# Altium project EDR.PrjPcb
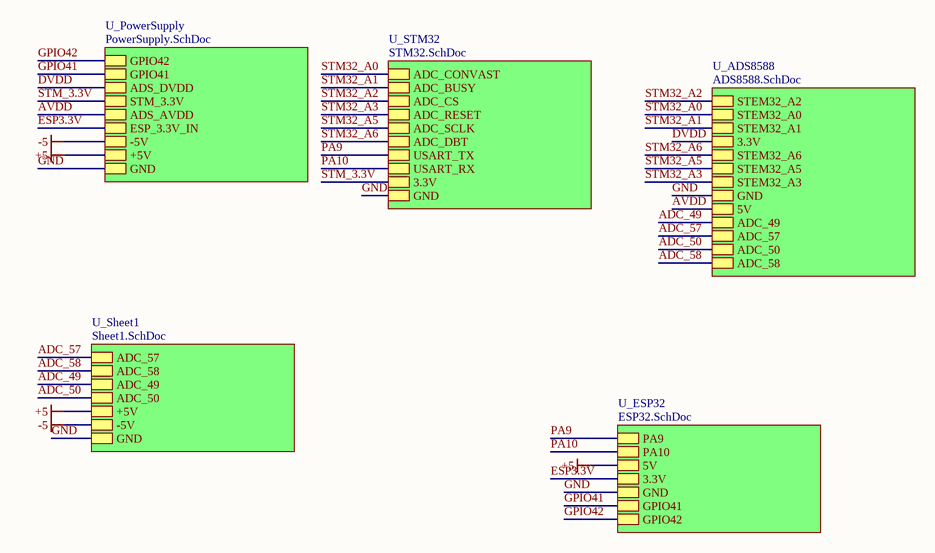
[diagram p0: Main.SchDoc]
6 sheets, 162 parts. Net scope: hierarchical (ports join the sheet entries above them; power ports are global).
Board file: EDR.PcbDoc
Sheets:
  Main.SchDoc
    U_PowerSupply = PowerSupply.SchDoc
    U_STM32 = STM32.SchDoc
    U_Sheet1 = Sheet1.SchDoc
    U_ADS8588 = ADS8588.SchDoc
    U_ESP32 = ESP32.SchDoc

## Sheet Main.SchDoc
size A; SheetNumber: 1; SheetTotal: 6

### Sub-sheets
U_ADS8588 = ADS8588.SchDoc: STEM32_A2, STEM32_A0, STEM32_A1, 3.3V, STEM32_A6, STEM32_A5, STEM32_A3, GND, 5V, ADC_49, ADC_57, ADC_50, ADC_58
U_ESP32 = ESP32.SchDoc: PA9, PA10, 5V, 3.3V, GND, GPIO41, GPIO42
U_PowerSupply = PowerSupply.SchDoc: GPIO42, GPIO41, ADS_DVDD, STM_3.3V, ADS_AVDD, ESP_3.3V_IN, -5V, +5V, GND
U_Sheet1 = Sheet1.SchDoc: ADC_57, ADC_58, ADC_49, ADC_50, +5V, -5V, GND
U_STM32 = STM32.SchDoc: ADC_CONVAST, ADC_BUSY, ADC_CS, ADC_RESET, ADC_SCLK, ADC_DBT, USART_TX, USART_RX, 3.3V, GND

### Nets
+5: sheet U_PowerSupply/+5V, sheet U_Sheet1/+5V, sheet U_ESP32/5V
-5: sheet U_PowerSupply/-5V, sheet U_Sheet1/-5V  [project net VOUT]
ESP3.3V: sheet U_PowerSupply/ESP_3.3V_IN, sheet U_ESP32/3.3V  [project net 3.3V]
GND: sheet U_PowerSupply/GND, sheet U_STM32/GND, sheet U_Sheet1/GND, sheet U_ADS8588/GND, sheet U_ESP32/GND
ADC_49: sheet U_Sheet1/ADC_49, sheet U_ADS8588/ADC_49
ADC_50: sheet U_Sheet1/ADC_50, sheet U_ADS8588/ADC_50
ADC_57: sheet U_Sheet1/ADC_57, sheet U_ADS8588/ADC_57
ADC_58: sheet U_Sheet1/ADC_58, sheet U_ADS8588/ADC_58
AVDD: sheet U_PowerSupply/ADS_AVDD, sheet U_ADS8588/5V  [project net 5V]
DVDD: sheet U_PowerSupply/ADS_DVDD, sheet U_ADS8588/3.3V  [project net 3.3V_ADC]
GPIO41: sheet U_PowerSupply/GPIO41, sheet U_ESP32/GPIO41
GPIO42: sheet U_PowerSupply/GPIO42, sheet U_ESP32/GPIO42
PA9: sheet U_STM32/USART_TX, sheet U_ESP32/PA9
PA10: sheet U_STM32/USART_RX, sheet U_ESP32/PA10
STM32_A0: sheet U_STM32/ADC_CONVAST, sheet U_ADS8588/STEM32_A0  [project net STEM32_A0]
STM32_A1: sheet U_STM32/ADC_BUSY, sheet U_ADS8588/STEM32_A1  [project net STEM32_A1]
STM32_A2: sheet U_STM32/ADC_CS, sheet U_ADS8588/STEM32_A2  [project net STEM32_A2]
STM32_A3: sheet U_STM32/ADC_RESET, sheet U_ADS8588/STEM32_A3  [project net STEM32_A3]
STM32_A5: sheet U_STM32/ADC_SCLK, sheet U_ADS8588/STEM32_A5  [project net STEM32_A5]
STM32_A6: sheet U_STM32/ADC_DBT, sheet U_ADS8588/STEM32_A6  [project net STEM32_A6]
STM_3.3V: sheet U_PowerSupply/STM_3.3V, sheet U_STM32/3.3V  [project net STEM32 3.3V]

## Sheet PowerSupply.SchDoc
size 420 x 297 mm; SheetNumber: 4; SheetTotal: 6
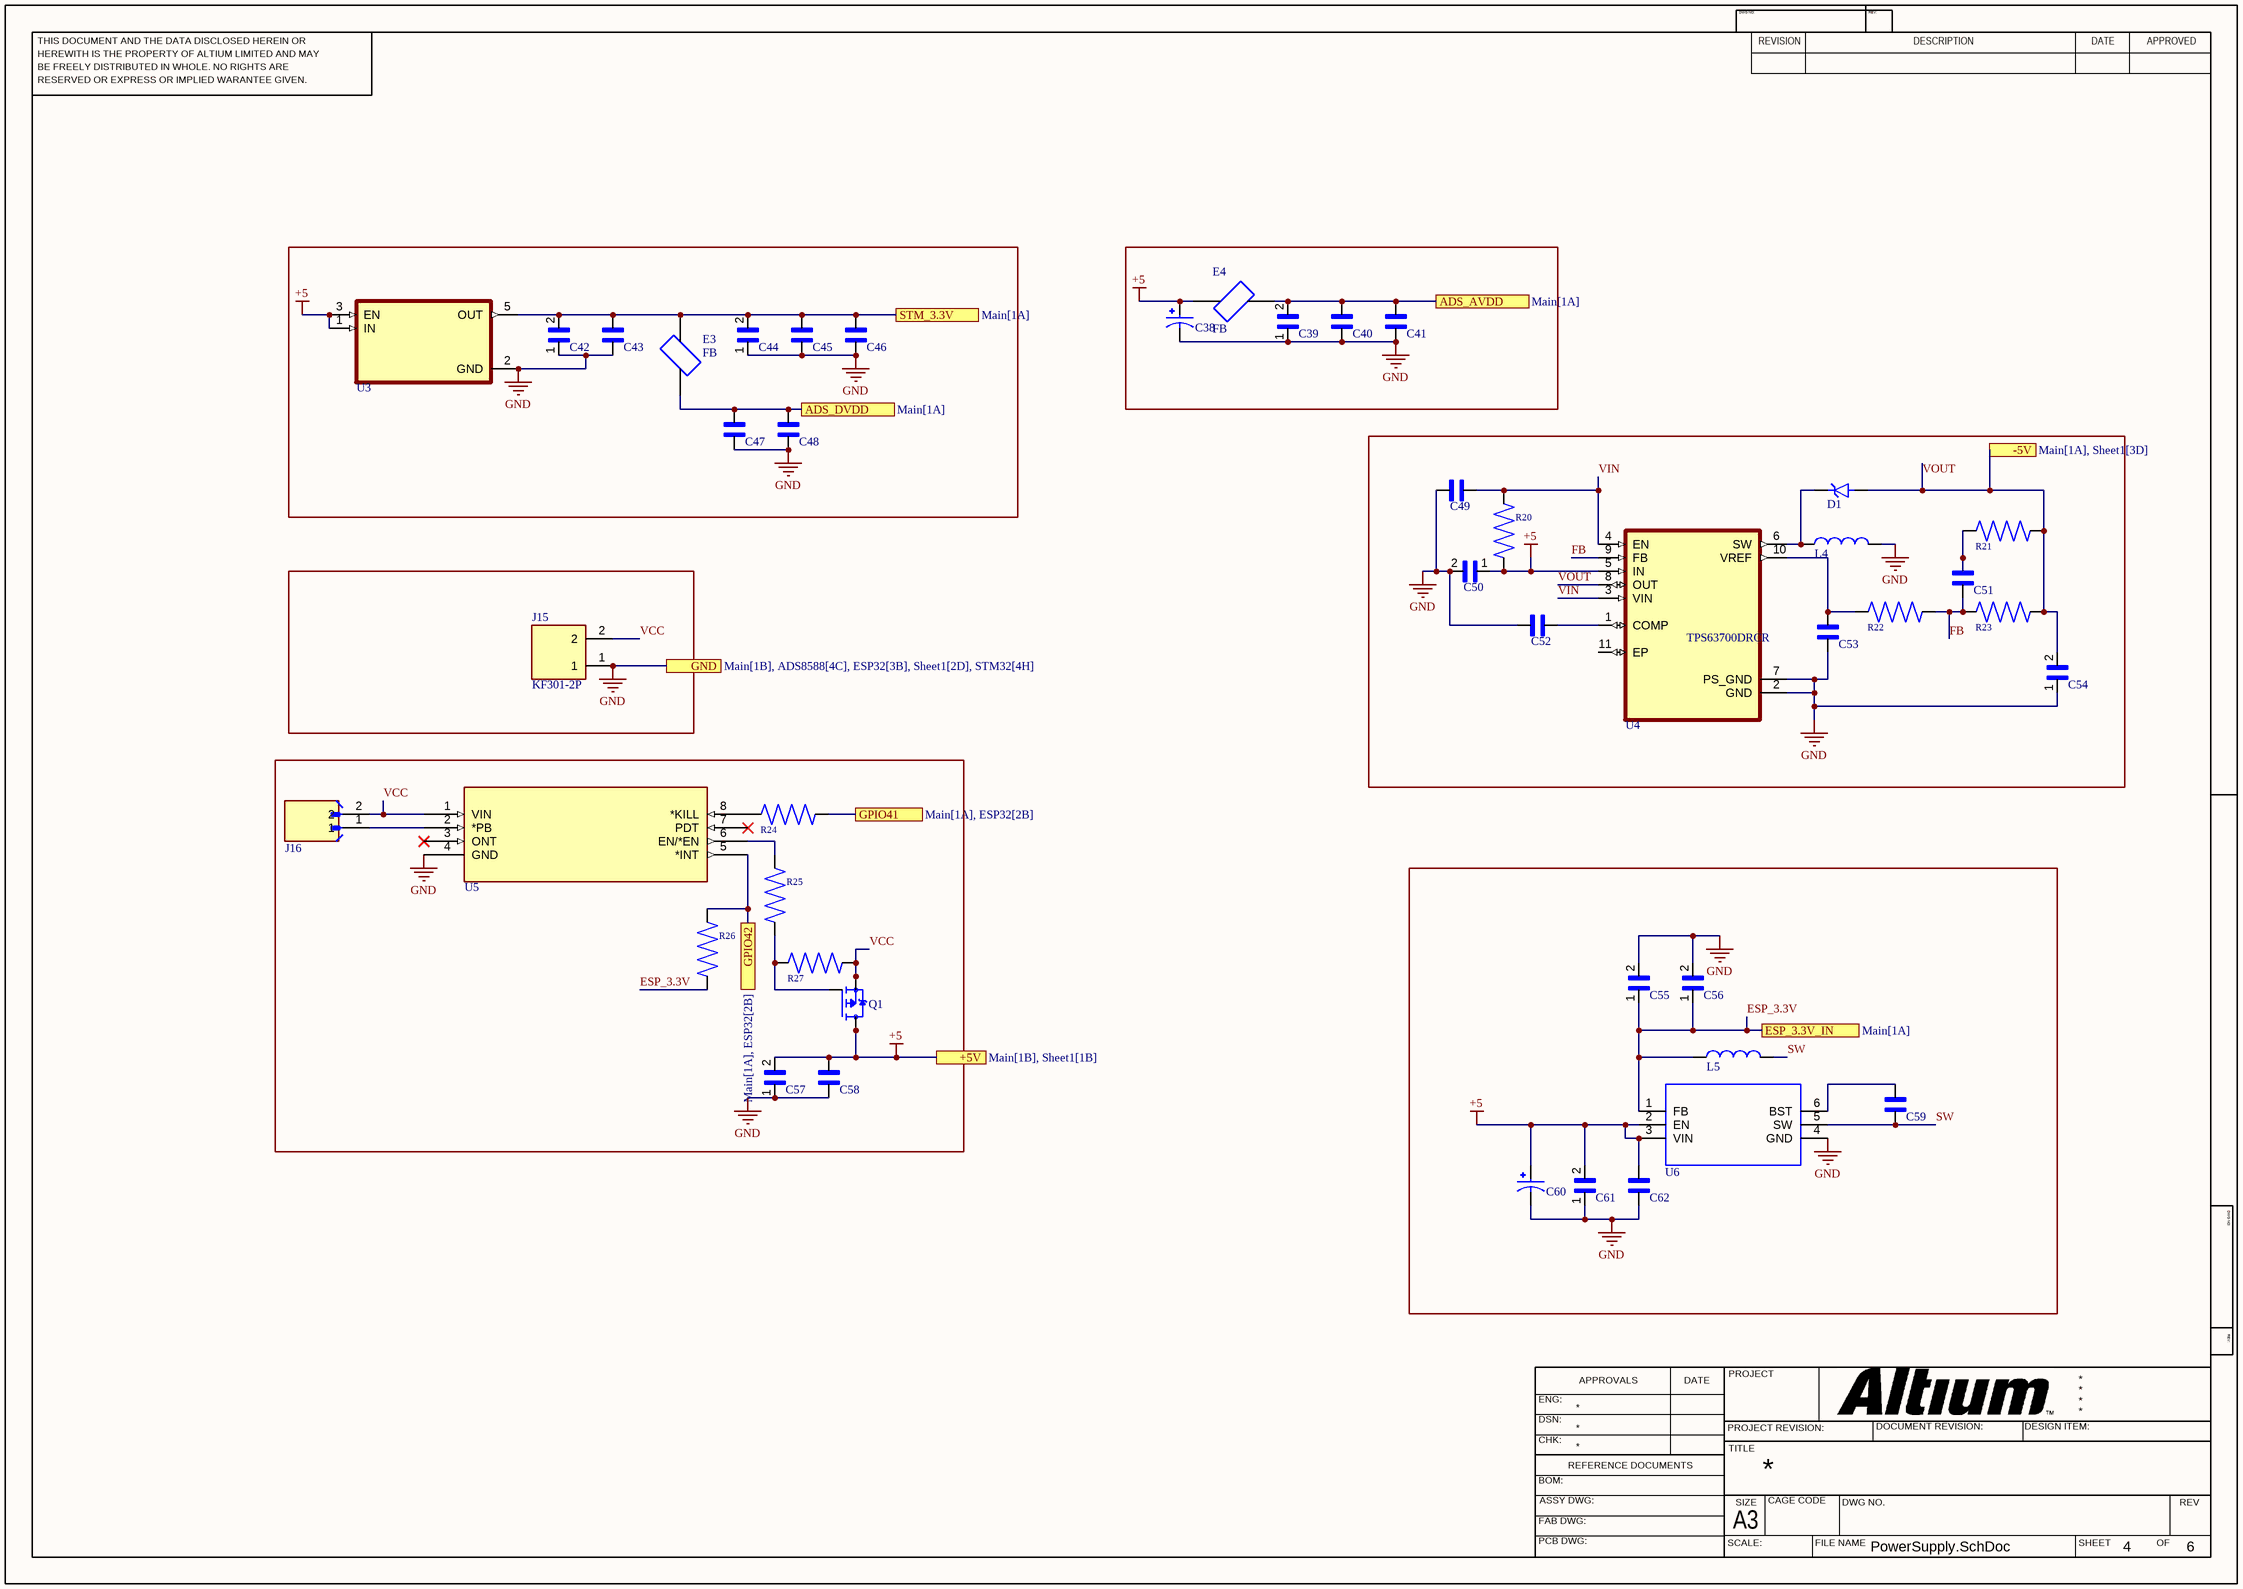
[diagram p1: PowerSupply.SchDoc]

### Parts
C38  100 uF  [100 uF]  (value not drawn)
C39  C2012X7R1H104K085AA  [CAPC2012X100N]  (value not drawn)
C40  CAP603  [CAP603]  (value not drawn)
C41  CAP603  [CAP603]  (value not drawn)
C42  C2012X7R1H104K085AA  [CAPC2012X100N]  (value not drawn)
C43  CAP603  [CAP603]  (value not drawn)
C44  C2012X7R1H104K085AA  [CAPC2012X100N]  (value not drawn)
C45  CAP603  [CAP603]  (value not drawn)
C46  CAP603  [CAP603]  (value not drawn)
C47  CAP603  [CAP603]  (value not drawn)
C48  CAP603  [CAP603]  (value not drawn)
C49  CAP603  [CAP603]  (value not drawn)
C50  C2012X7R1H104K085AA  [CAPC2012X100N]  (value not drawn)
C51  CAP603  [CAP603]  (value not drawn)
C52  CAP603  [CAP603]  (value not drawn)
C53  CAP603  [CAP603]  (value not drawn)
C54  C2012X7R1H104K085AA  [CAPC2012X100N]  (value not drawn)
C55  C2012X7R1H104K085AA  [CAPC2012X100N]  (value not drawn)
C56  C2012X7R1H104K085AA  [CAPC2012X100N]  (value not drawn)
C57  C2012X7R1H104K085AA  [CAPC2012X100N]  (value not drawn)
C58  CAP603  [CAP603]  (value not drawn)
C59  CAP603  [CAP603]  (value not drawn)
C60  100 uF  [100 uF]  (value not drawn)
C61  C2012X7R1H104K085AA  [CAPC2012X100N]  (value not drawn)
C62  CAP603  [CAP603]  (value not drawn)
D1  zenor diode  [zenor diode]  (value not drawn)
E3  FB  [FB_MI1206K601R-10]
E4  FB  [FB_MI1206K601R-10]
J15  KF301-2P  [HANDSON_KF301-2P]
J16  2-pin jst  [2-pin jst]  (value not drawn)
L4  inductor  [inductor]  (value not drawn)
L5  inductor  [inductor]  (value not drawn)
Q1  AO4407A  [AO4407A]  (value not drawn)
R20  RES-603  [CAP603]  (value not drawn)
R21  RES-603  [CAP603]  (value not drawn)
R22  RES-603  [CAP603]  (value not drawn)
R23  RES-603  [CAP603]  (value not drawn)
R24  RES-603  [CAP603]  (value not drawn)
R25  RES-603  [CAP603]  (value not drawn)
R26  RES-603  [CAP603]  (value not drawn)
R27  RES-603  [CAP603]  (value not drawn)
U3  TLV75533PDBVR  [TLV75533PDBVR]  (value not drawn)
U4  TPS63700DRCR  [TPS63700DRCR]
U5  LTC2954CTS8-1#TRMPBF  [LTC2954CTS8-1#TRMPBF]  (value not drawn)
U6  AP63203WU-7  [AP63203WU-7]  (value not drawn)

### Ports
+5V (see Main[1B], Sheet1[1B]), -5V (see Main[1A], Sheet1[3D]), ADS_AVDD (see Main[1A]), ADS_DVDD (see Main[1A]), ESP_3.3V_IN (see Main[1A]), GND (see Main[1B], ADS8588[4C], ESP32[3B], Sheet1[2D], STM32[4H]), GPIO41 (see Main[1A], ESP32[2B]), GPIO42 (see Main[1A], ESP32[2B]), STM_3.3V (see Main[1A])

### Nets
+5: C38.1 C50.1 C57.2 C58.2 C60.1 C61.2 C62.2 E4.2 Q1.5(D) Q1.6(D) Q1.7(D) Q1.8(D) R20.1 U3.1(IN) U3.3(EN) U4.5(IN) U6.2(EN) U6.3(VIN) ; port +5V
ESP_3.3V: C55.1 C56.1 L5.1 R26.1 U6.1(FB) ; port ESP_3.3V_IN  [project net 3.3V]
GND: C38.2 C39.1 C40.1 C41.1 C42.1 C43.1 C44.1 C45.1 C46.1 C47.1 C48.1 C49.2 C50.2 C52.2 C53.1 C54.1 C55.2 C56.2 C57.1 C58.1 C60.2 C61.1 C62.1 J15.1 L4.2 U3.2(GND) U4.2(GND) U4.7(PS_GND) U5.4(GND) U6.4(GND) ; port GND
VOUT: C54.2 D1.A R21.2 R23.2 U4.8(OUT) ; port -5V
3.3V_ADC: C47.2 C48.2 E3.1 ; port ADS_DVDD
5V: C39.2 C40.2 C41.2 E4.1 ; port ADS_AVDD
FB: C51.1 R22.2 R23.1 U4.9(FB)
GPIO41: R24.2 ; port GPIO41
GPIO42: R26.2 U5.5(*INT) ; port GPIO42
STEM32 3.3V: C42.2 C43.2 C44.2 C45.2 C46.2 E3.2 U3.5(OUT) ; port STM_3.3V
SW: C59.1 L5.2 U6.5(SW)
VCC: J15.2 J16.2 Q1.1(S) Q1.2(S) Q1.3(S) R27.2 U5.1(VIN)
VIN: C49.1 R20.2 U4.3(VIN) U4.4(EN)
NetC51_2: C51.2 R21.1
NetC52_1: C52.1 U4.1(COMP)
NetC53_2: C53.2 R22.1 U4.10(VREF)
NetC59_2: C59.2 U6.6(BST)
NetD1_C: D1.C(K) L4.1 U4.6(SW)
NetJ16_1: J16.1 U5.2(*PB)
NetQ1_4: Q1.4(G) R25.2 R27.1
NetR24_1: R24.1 U5.8(*KILL)
NetR25_1: R25.1 U5.6(EN/*EN)

Not connected (* = marked no-connect by the designer): U4 11(EP); U5 3(ONT)* 7(PDT)*

### Notes on the sheet
- THIS DOCUMENT AND THE DATA DISCLOSED HEREIN OR
- HEREWITH IS THE PROPERTY OF ALTIUM LIMITED AND MAY
- DWG NO:
- REVISION
- REV:
- DESCRIPTION
- DATE
- APPROVED
- BE FREELY DISTRIBUTED IN WHOLE. NO RIGHTS ARE
- RESERVED OR EXPRESS OR IMPLIED WARANTEE GIVEN.
- ENG:
- APPROVALS
- PROJECT
- DSN:
- CHK:
- REFERENCE DOCUMENTS
- PROJECT REVISION:
- TITLE
- DOCUMENT REVISION:
- DESIGN ITEM:
- BOM:
- FAB DWG:
- PCB DWG:
- ASSY DWG:
- SCALE:
- A3
- SIZE
- CAGE CODE
- FILE NAME
- DWG NO.
- SHEET
- OF
- REV

### Library data of the parts
C38 C60 = 100 uF: Capacitor, Polymer Aluminum, Radial, 12mOhm, 100 CAP, 16V, SVPG, Surface Mount | Panasonic Electronic Components 16SVPG100M; SnapEDA_Link: https://www.snapeda.com/parts/16SVPG100M/Panasonic/view-part/?ref=snap; Package: None; Value: *; MF: Panasonic; MP: 16SVPG100M; Check_prices: https://www.snapeda.com/parts/16SVPG100M/Panasonic/view-part/?ref=eda
C39 C42 C44 C50 C54-C57 C61 = C2012X7R1H104K085AA: 0.1 ÂµF Â±10% 50V Ceramic Capacitor X7R 0805 (2012 Metric); MF: TDK; Purchase-URL: https://pricing.snapeda.com/search/part/C2012X7R1H104K085AA/?ref=eda; Package: 2012 TDK; MP: C2012X7R1H104K085AA; Value: *; SnapEDA_Link: https://www.snapeda.com/parts/C2012X7R1H104K085AA/TDK/view-part/?ref=snap; Digi-Key_Part_Number: 445-7534-1-ND; Check_prices: https://www.snapeda.com/parts/C2012X7R1H104K085AA/TDK/view-part/?ref=eda
C40 C41 C43 C45-C49 C51-C53 C58 C59 C62 = CAP603: 0.1 ÂµF Â±5% 10V Ceramic Capacitor X7R 0603 (1608 Metric); MF: Vishay; MP: VJ0603Y104JXQCW1BC; SnapEDA_Link: https://www.snapeda.com/parts/VJ0603Y104JXQCW1BC/Vishay/view-part/?ref=snap; Package: 0603-2 VISHAY; Value: *; Check_prices: https://www.snapeda.com/parts/VJ0603Y104JXQCW1BC/Vishay/view-part/?ref=eda
D1 = zenor diode: DO-214AC (SMA), 1250mW, 5%, Zener Diode; MF: Taiwan Semiconductor; MP: 1SMA4746H; SnapEDA_Link: https://www.snapeda.com/parts/1SMA4746H/taiwan/view-part/?ref=snap; Package: SMA-2 Taiwan Semiconductor; Value: *; Check_prices: https://www.snapeda.com/parts/1SMA4746H/taiwan/view-part/?ref=eda
E3 E4 = MI1206K601R-10: 600 Ohms @ 100 MHz 1 Power, Signal Line Ferrite Bead 1206 (3216 Metric) 1.5A 80mOhm; MF: Laird-Signal Integrity; SnapEDA_Link: https://www.snapeda.com/parts/MI1206K601R-10/Laird-Signal+Integrity+Products/view-part/?ref=snap; Package: 1206 Laird; Value: *; MP: MI1206K601R-10; Check_prices: https://www.snapeda.com/parts/MI1206K601R-10/Laird-Signal+Integrity+Products/view-part/?ref=eda
J15 = KF301-2P: 2 Pin Terminal Block 5mm Pitch; MF: Handson Technology; SnapEDA_Link: https://www.snapeda.com/parts/KF301-2P/Handson+Technology/view-part/?ref=snap; Package: None; Value: *; MP: KF301-2P; Check_prices: https://www.snapeda.com/parts/KF301-2P/Handson+Technology/view-part/?ref=eda
J16 = 2-pin jst: Connector Header Through Hole 2 position 0.079 (2.00mm); MF: JST Sales America Inc.; MP: B2B-PH-K-S; SnapEDA_Link: https://www.snapeda.com/parts/B2B-PH-K-S/JST/view-part/?ref=snap; Package: None; Value: *; Check_prices: https://www.snapeda.com/parts/B2B-PH-K-S/JST/view-part/?ref=eda
L4 L5 = inductor: Inductor with Inductance: 4.7uH Tol. +/-20%, Package: 0603 _1608_; MF: Murata Electronics; MP: LQM18PN4R7MFRL; SnapEDA_Link: https://www.snapeda.com/parts/LQM18PN4R7MFRL/Murata%20Electronics%20North%20America/view-part/1499515/?ref=snap; Availability: Unavailable; Value: *; Price: None; Package: 1608 Murata
Q1 = AO4407A: P-Channel 30 V 12A (Ta) 3.1W (Ta) Surface Mount 8-SOIC; MF: Alpha &; SnapEDA_Link: https://www.snapeda.com/parts/AO4407A/Alpha/view-part/?ref=snap; Package: SOIC-8 Alpha &amp; Omega Semiconductor; Value: *; MP: AO4407A; Check_prices: https://www.snapeda.com/parts/AO4407A/Alpha/view-part/?ref=eda
R20-R27 = RES-603: MF: Yageo; MP: RC0805FR-0710KL; Value: *; SnapEDA_Link: https://www.snapeda.com/parts/RC0805FR-0710KL/Yageo/view-part/?ref=snap; Purchase-URL: https://pricing.snapeda.com/search/part/RC0805FR-0710KL/?ref=eda; Availability: In Stock; Price: None; Package: 2012 Rohm Semiconductor; Check_prices: https://www.snapeda.com/parts/RC0805FR-0710KL/Yageo/view-part/?ref=eda
U3 = TLV75533PDBVR: 500-mA High-PSRR Low-IQ-Tief-Dropout-Spannungsregler mitablem; MF: Texas Instruments; SnapEDA_Link: https://www.snapeda.com/parts/TLV75533PDBVR/Texas+Instruments/view-part/?ref=snap; Package: SOT-23-5 Texas Instruments; Value: *; MP: TLV75533PDBVR; Check_prices: https://www.snapeda.com/parts/TLV75533PDBVR/Texas+Instruments/view-part/?ref=eda
U4 = TPS63700DRCR: Adjustable, -15V Output Inverting DC/DC Converter in 3x3 QFN; MF: Texas Instruments; SnapEDA_Link: https://www.snapeda.com/parts/TPS63700DRCR/Texas+Instruments/view-part/?ref=snap; Package: VSON-10 Texas Instruments; Value: *; MP: TPS63700DRCR; Check_prices: https://www.snapeda.com/parts/TPS63700DRCR/Texas+Instruments/view-part/?ref=eda
U5 = LTC2954CTS8-1#TRMPBF: MF: {'manufacturer': u'Analog Devices Inc.'}; Package: None; Price: None; Value: *; MP: LTC2954CTS8-1#TRMPBF; Availability: Unavailable
U6 = AP63203WU-7: Buck Switching Regulator IC Positive Fixed 3.3V 1 Output 2A SOT-23-6 Thin, TSOT-23-6; MF: Diodes Zetex; SnapEDA_Link: https://www.snapeda.com/parts/AP63203WU-7/Diodes+Inc./view-part/?ref=snap; Package: SOT-23-6 Diodes Incorporated; Value: *; MP: AP63203WU-7; Check_prices: https://www.snapeda.com/parts/AP63203WU-7/Diodes+Inc./view-part/?ref=eda

## Sheet STM32.SchDoc
size A3 portrait; SheetNumber: 6; SheetTotal: 6
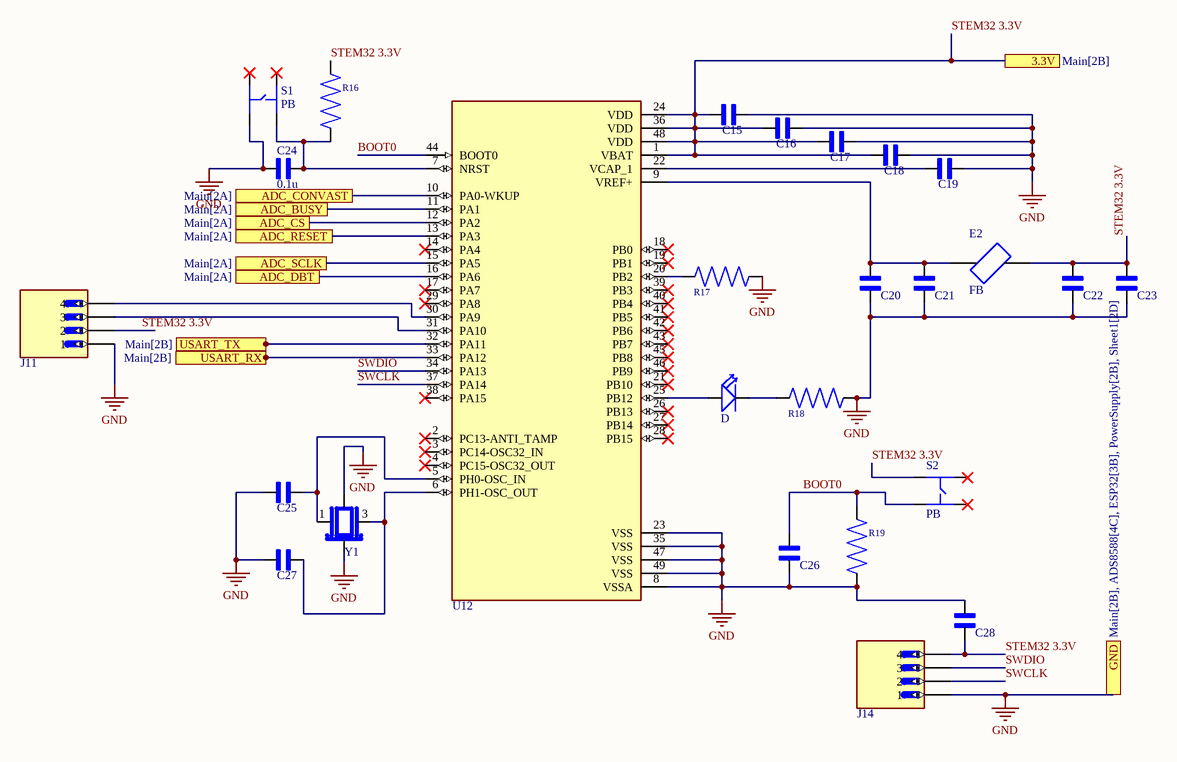
[diagram p2: STM32.SchDoc]

### Parts
C15  CAP603  [CAP603]  (value not drawn)
C16  CAP603  [CAP603]  (value not drawn)
C17  CAP603  [CAP603]  (value not drawn)
C18  CAP603  [CAP603]  (value not drawn)
C19  CAP603  [CAP603]  (value not drawn)
C20  CAP603  [CAP603]  (value not drawn)
C21  CAP603  [CAP603]  (value not drawn)
C22  CAP603  [CAP603]  (value not drawn)
C23  CAP603  [CAP603]  (value not drawn)
C24  0.1u  [0603Capacitor]
C25  CAP603  [CAP603]  (value not drawn)
C26  CAP603  [CAP603]  (value not drawn)
C27  CAP603  [CAP603]  (value not drawn)
C28  CAP603  [CAP603]  (value not drawn)
D  SMD-LED-YELLOW-WHITE(0603)  [LED-0603]  (value not drawn)
E2  FB  [FB_MI1206K601R-10]
J11  4-pin header  [4-pin header]  (value not drawn)
J14  4-pin header  [4-pin header]  (value not drawn)
R16  RES-603  [CAP603]  (value not drawn)
R17  RES-603  [CAP603]  (value not drawn)
R18  RES-603  [CAP603]  (value not drawn)
R19  RES-603  [CAP603]  (value not drawn)
S1  PB  [Push_button]
S2  PB  [Push_button]
U12  STM32F411CEU6TR  [STM32F411CEU6TR]  (value not drawn)
Y1  25 MHz oscillator  [25 MHz oscillator]  (value not drawn)

### Ports
3.3V (see Main[2B]), ADC_BUSY (see Main[2A]), ADC_CONVAST (see Main[2A]), ADC_CS (see Main[2A]), ADC_DBT (see Main[2A]), ADC_RESET (see Main[2A]), ADC_SCLK (see Main[2A]), GND (see Main[2B], ADS8588[4C], ESP32[3B], PowerSupply[2B], Sheet1[2D]), USART_RX (see Main[2B]), USART_TX (see Main[2B])

### Nets
GND: C15.2 C16.2 C17.2 C18.2 C19.2 C20.1 C21.1 C22.1 C23.1 C24.1 C25.1 C26.1 C27.1 C28.2 J11.1 J14.1 R17.2 R18.2 R19.1 S1.1 U12.8(VSSA) U12.23(VSS) U12.35(VSS) U12.47(VSS) U12.49(VSS) Y1.2(GND) Y1.4(GND) ; port GND
BOOT0: C26.2 R19.2 S2.3 U12.44(BOOT0)
PA9: U12.32(PA11) ; port USART_TX
PA10: U12.33(PA12) ; port USART_RX
STEM32 3.3V: C15.1 C16.1 C17.1 C18.1 C22.2 C23.2 C28.1 E2.2 J11.2 J14.4 R16.2 S2.1 U12.1(VBAT) U12.24(VDD) U12.36(VDD) U12.48(VDD) ; port 3.3V
STEM32_A0: U12.10(PA0-WKUP) ; port ADC_CONVAST
STEM32_A1: U12.11(PA1) ; port ADC_BUSY
STEM32_A2: U12.12(PA2) ; port ADC_CS
STEM32_A3: U12.13(PA3) ; port ADC_RESET
STEM32_A5: U12.15(PA5) ; port ADC_SCLK
STEM32_A6: U12.16(PA6) ; port ADC_DBT
SWCLK: J14.2 U12.37(PA14)
SWDIO: J14.3 U12.34(PA13)
NetC19_1: C19.1 U12.22(VCAP_1)
NetC20_2: C20.2 C21.2 E2.1 U12.9(VREF+)
NetC24_2: C24.2 R16.1 S1.3 U12.7(NRST)
NetC25_2: C25.2 U12.5(PH0-OSC_IN) Y1.1
NetC27_2: C27.2 U12.6(PH1-OSC_OUT) Y1.3
NetD_NEG: D.NEG R18.1
NetD_POS: D.POS U12.25(PB12)
NetJ11_3: J11.3 U12.31(PA10)
NetJ11_4: J11.4 U12.30(PA9)
NetR17_1: R17.1 U12.20(PB2)

Not connected (* = marked no-connect by the designer): S1 2* 4; S2 2* 4; U12 2(PC13-ANTI_TAMP)* 3(PC14-OSC32_IN)* 4(PC15-OSC32_OUT)* 14(PA4)* 17(PA7)* 18(PB0)* 19(PB1)* 21(PB10)* 26(PB13)* 27(PB14)* 28(PB15)* 29(PA8)* 38(PA15)* 39(PB3)* 40(PB4)* 41(PB5)* 42(PB6)* 43(PB7)* 45(PB8)* 46(PB9)*

### Notes on the sheet
- Title
- Size:
- Date:
- A3
- Number:
- Time:
- Revision:
- Sheet
- of
- File:

### Library data of the parts
C15-C23 C25-C28 = CAP603: as C40 on sheet PowerSupply; SnapEDA_Link: https://www.snapeda.com/parts/VJ0603Y104JXQCW1BC/Vishay/view-part/?ref=snap; Package: 0603-2 VISHAY; Value: *; Check_prices: https://www.snapeda.com/parts/VJ0603Y104JXQCW1BC/Vishay/view-part/?ref=eda
C24 = 0603_0.1u: 100nf,X7R,50V; MF: AVX; MP: 0603YC223KAT2A; SnapEDA_Link: https://www.snapeda.com/parts/0603YC223KAT2A/AVX/view-part/?ref=snap; Package: 1608 AVX; Value: *; Check_prices: https://www.snapeda.com/parts/0603YC223KAT2A/AVX/view-part/?ref=eda
D = SMD-LED-YELLOW-WHITE(0603): SMD LED Yellow-White; MF: Chengguangxing; MP: ADL-0603W; SnapEDA_Link: https://www.snapeda.com/parts/ADL-0603W/Chengguangxing/view-part/106378/?ref=snap; Availability: Unavailable; Value: *; Price: None; Package: None
E2 = MI1206K601R-10: as E3 on sheet PowerSupply; SnapEDA_Link: https://www.snapeda.com/parts/MI1206K601R-10/Laird-Signal+Integrity+Products/view-part/?ref=snap; Package: 1206 Laird; Value: *; MP: MI1206K601R-10; Check_prices: https://www.snapeda.com/parts/MI1206K601R-10/Laird-Signal+Integrity+Products/view-part/?ref=eda
J11 J14 = 4-pin header: BergStikÂ®, Board to Board connector, Unshrouded Header, Through Hole, Single Row, 4 Positions, 2.54 mm Pitch, Vertical, 5.84 mm (0.23 in.) Mating, 2.41 mm (0.095 in.) Tail; MF: FCI; MP: 68000-104HLF; SnapEDA_Link: https://www.snapeda.com/parts/68000-104HLF/Amphenol+FCI/view-part/?ref=snap; Package: None; Value: *; Check_prices: https://www.snapeda.com/parts/68000-104HLF/Amphenol+FCI/view-part/?ref=eda
R16-R19 = RES-603: MF: Yageo; MP: RC0805FR-0710KL; Value: *; SnapEDA_Link: https://www.snapeda.com/parts/RC0805FR-0710KL/Yageo/view-part/?ref=snap; Purchase-URL: https://pricing.snapeda.com/search/part/RC0805FR-0710KL/?ref=eda; Availability: In Stock; Price: None; Package: 2012 Rohm Semiconductor; Check_prices: https://www.snapeda.com/parts/RC0805FR-0710KL/Yageo/view-part/?ref=eda
S1 S2 = PushButton
U12 = STM32F411CEU6TR: ARMÂ® CortexÂ®-M4 series Microcontroller IC 32-Bit Single-Core 100MHz 512KB (512K x 8) FLASH 48-UFQFPN (7x7); MF: STMicroelectronics; Value: *; MP: STM32F411CEU6TR; Package: UFQFN-48 STMicroelectronics; Availability: In Stock; Price: None; SnapEDA_Link: https://www.snapeda.com/parts/STM32F411CEU6TR/STMicroelectronics/view-part/?ref=snap; Check_prices: https://www.snapeda.com/parts/STM32F411CEU6TR/STMicroelectronics/view-part/?ref=eda; Purchase-URL: https://pricing.snapeda.com/search/part/STM32F411CEU6TR/?ref=eda
Y1 = 25 MHz oscillator: 25 MHz 10ppm Crystal 18pF 30 Ohms 4-SMD, No Lead (3.20mm x 2.50mm); MF: Raltron Electronics; MP: RH100-25.000-18-F-1015-TR-NS2; SnapEDA_Link: https://www.snapeda.com/parts/RH100-25.000-18-F-1015-TR-NS2/Raltron+Electronics/view-part/?ref=snap; Package: None; Value: *; Check_prices: https://www.snapeda.com/parts/RH100-25.000-18-F-1015-TR-NS2/Raltron+Electronics/view-part/?ref=eda

## Sheet Sheet1.SchDoc
size A; SheetNumber: 5; SheetTotal: 6
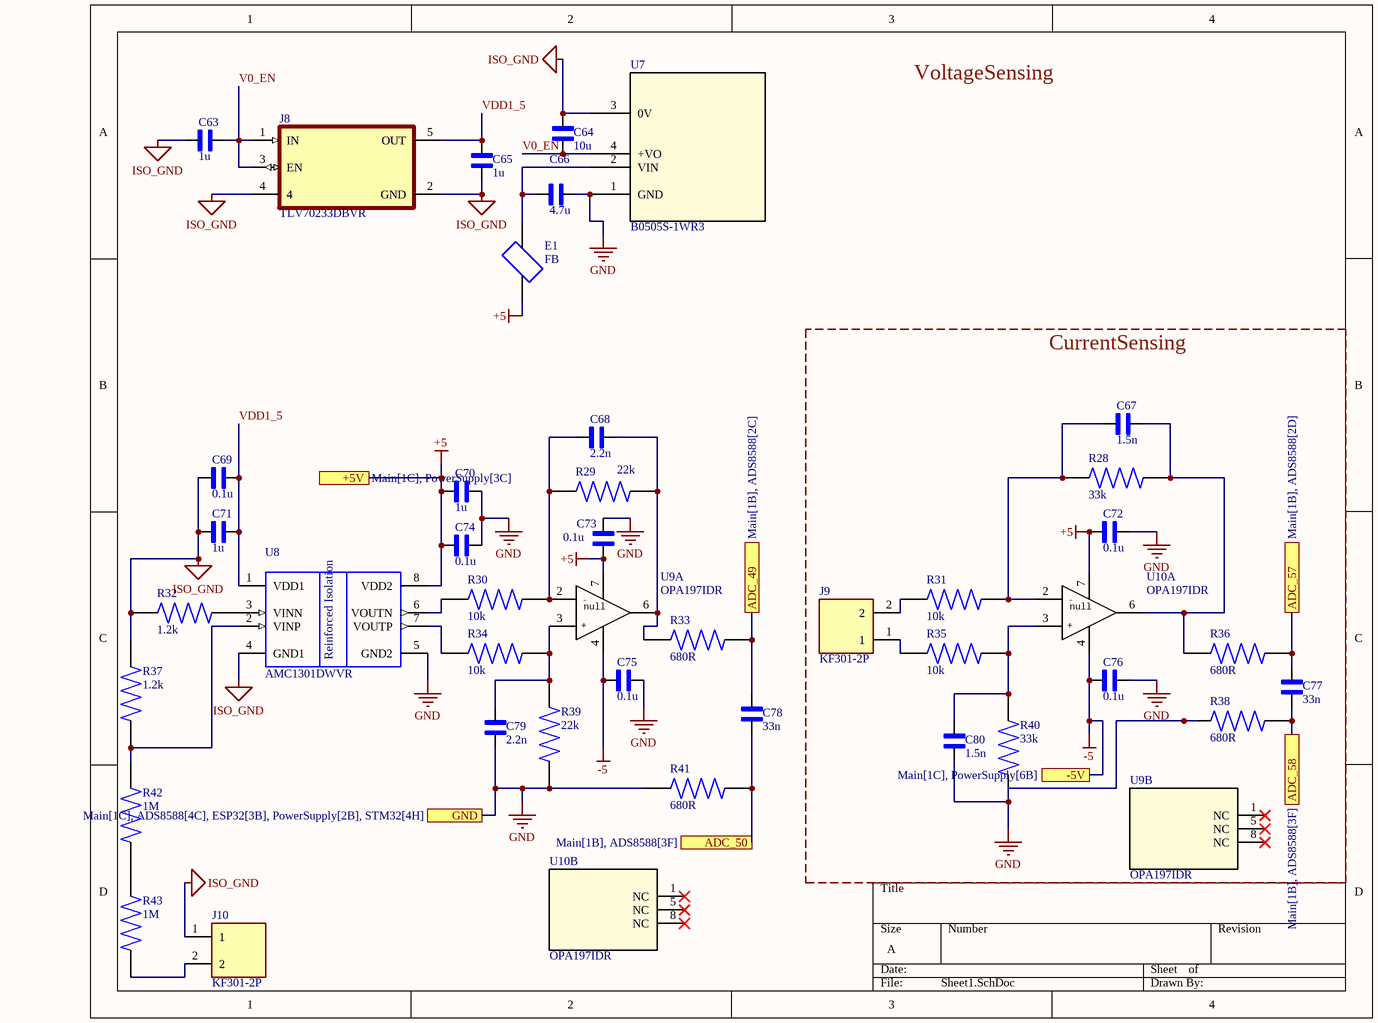
[diagram p3: Sheet1.SchDoc]

### Parts
C63  1u  [0603Capacitor]
C64  10u  [0603Capacitor]
C65  1u  [0603Capacitor]
C66  4.7u  [0603Capacitor]
C67  1.5n  [0603Capacitor]
C68  2.2n  [0603Capacitor]
C69  0.1u  [0603Capacitor]
C70  1u  [0603Capacitor]
C71  1u  [0603Capacitor]
C72  0.1u  [0603Capacitor]
C73  0.1u  [0603Capacitor]
C74  0.1u  [0603Capacitor]
C75  0.1u  [0603Capacitor]
C76  0.1u  [0603Capacitor]
C77  33n  [CAPC1206]
C78  33n  [CAPC1206]
C79  2.2n  [0603Capacitor]
C80  1.5n  [0603Capacitor]
E1  FB  [FB_MI1206K601R-10]
J8  TLV70233DBVR  [TLV70233]
J9  KF301-2P  [HANDSON_KF301-2P]
J10  KF301-2P  [HANDSON_KF301-2P]
R28  33k  [0603Resistor]
R29  22k  [0603Resistor]
R30  10k  [0603Resistor]
R31  10k  [0603Resistor]
R32  1.2k  [0603Resistor]
R33  680R  [0603Resistor]
R34  10k  [0603Resistor]
R35  10k  [0603Resistor]
R36  680R  [0603Resistor]
R37  1.2k  [0603Resistor]
R38  680R  [0603Resistor]
R39  22k  [0603Resistor]
R40  33k  [0603Resistor]
R41  680R  [0603Resistor]
R42  1M  [1M_1206]
R43  1M  [1M_1206]
U7  B0505S-1WR3  [B0505S]
U8  AMC1301DWVR  [AMC1301]
U9  OPA197IDR  [D0008A-MFG]  (parts A,B of 2)
U10  OPA197IDR  [D0008A-MFG]  (parts A,B of 2)

### Blocks framed on the sheet
CurrentSensing: C67 C72 C76 C77 C80 J9 R28 R31 R35 R36 R38 R40 U9 U10

### Ports
+5V (see Main[1C], PowerSupply[3C]), -5V (see Main[1C], PowerSupply[6B]), ADC_49 (see Main[1B], ADS8588[2C]), ADC_50 (see Main[1B], ADS8588[3F]), ADC_57 (see Main[1B], ADS8588[2D]), ADC_58 (see Main[1B], ADS8588[3F]), GND (see Main[1C], ADS8588[4C], ESP32[3B], PowerSupply[2B], STM32[4H])

### Nets
+5: C70.1 C72.1 C73.1 C74.1 E1.1 U8.8(VDD2) U9.7(V+) U10.7(V+) ; port +5V
-5: C75.1 C76.1 U9.4(V-) U10.4(V-) ; port -5V  [project net VOUT]
GND: C66.2 C70.2 C72.2 C73.2 C74.2 C75.2 C76.2 C79.1 C80.1 R38.1 R39.1 R40.1 R41.1 U7.1(GND) U8.5(GND2) ; port GND
ISO_GND: C63.1 C64.2 C65.1 C69.1 C71.1 J8.2(GND) J8.4 J10.1 R32.1 R37.2 U7.3(0V) U8.4(GND1)
ADC_49: C78.2 R33.2 ; port ADC_49
ADC_50: C78.1 R41.2 ; port ADC_50
ADC_57: C77.2 R36.2 ; port ADC_57
ADC_58: C77.1 R38.2 ; port ADC_58
V0_EN: C63.2 C64.1 J8.1(IN) J8.3(EN) U7.4(+VO)
VDD1_5: C65.2 C69.2 C71.2 J8.5(OUT) U8.1(VDD1)
NetC66_1: C66.1 E1.2 U7.2(VIN)
NetC67_1: C67.1 R28.1 R31.2 U10.2(-IN)
NetC67_2: C67.2 R28.2 R36.1 U10.6(OUT)
NetC68_1: C68.1 R29.1 R30.2 U9.2(-IN)
NetC68_2: C68.2 R29.2 R33.1 U9.6(OUT)
NetC79_2: C79.2 R34.2 R39.2 U9.3(+IN)
NetC80_2: C80.2 R35.2 R40.2 U10.3(+IN)
NetJ9_1: J9.1 R35.1
NetJ9_2: J9.2 R31.1
NetJ10_2: J10.2 R43.1
NetR30_1: R30.1 U8.6(VOUTN)
NetR32_2: R32.2 U8.3(VINN)
NetR34_1: R34.1 U8.7(VOUTP)
NetR37_1: R37.1 R42.2 U8.2(VINP)
NetR42_1: R42.1 R43.2

Not connected (* = marked no-connect by the designer): U9 1(NC)* 5(NC)* 8(NC)*; U10 1(NC)* 5(NC)* 8(NC)*

### Notes on the sheet
- VoltageSensing
- (in symbol AMC1301DWVR) Reinforced Isolation
- (in symbol OPA197IDR, part A) -; null; +

### Library data of the parts
C63 C65 C70 C71 = 0603_1u: 1uF,X7R,50V; MF: AVX; MP: 0603YC223KAT2A; SnapEDA_Link: https://www.snapeda.com/parts/0603YC223KAT2A/AVX/view-part/?ref=snap; Package: 1608 AVX; Value: *; Check_prices: https://www.snapeda.com/parts/0603YC223KAT2A/AVX/view-part/?ref=eda
C64 = 0603_10u: 10uF,X7R,50V; MF: AVX; MP: 0603YC223KAT2A; SnapEDA_Link: https://www.snapeda.com/parts/0603YC223KAT2A/AVX/view-part/?ref=snap; Package: 1608 AVX; Value: *; Check_prices: https://www.snapeda.com/parts/0603YC223KAT2A/AVX/view-part/?ref=eda
C66 = 0603_4.7u: 4.7uF,X7R,50V; MF: AVX; MP: 0603YC223KAT2A; SnapEDA_Link: https://www.snapeda.com/parts/0603YC223KAT2A/AVX/view-part/?ref=snap; Package: 1608 AVX; Value: *; Check_prices: https://www.snapeda.com/parts/0603YC223KAT2A/AVX/view-part/?ref=eda
C67 C80 = 0603_1.5nf: 1.5nf_C0G_50V; MF: AVX; MP: 0603YC223KAT2A; SnapEDA_Link: https://www.snapeda.com/parts/0603YC223KAT2A/AVX/view-part/?ref=snap; Package: 1608 AVX; Value: *; Check_prices: https://www.snapeda.com/parts/0603YC223KAT2A/AVX/view-part/?ref=eda
C68 C79 = 0603_2.2n: 2.2nF,C0G,50V; MF: AVX; MP: 0603YC223KAT2A; SnapEDA_Link: https://www.snapeda.com/parts/0603YC223KAT2A/AVX/view-part/?ref=snap; Package: 1608 AVX; Value: *; Check_prices: https://www.snapeda.com/parts/0603YC223KAT2A/AVX/view-part/?ref=eda
C69 C72-C76 = 0603_0.1u: as C24 on sheet STM32; SnapEDA_Link: https://www.snapeda.com/parts/0603YC223KAT2A/AVX/view-part/?ref=snap; Package: 1608 AVX; Value: *; Check_prices: https://www.snapeda.com/parts/0603YC223KAT2A/AVX/view-part/?ref=eda
C77 C78 = 0603_33n: 33nf_C0G_50V; MF: AVX; MP: 0603YC223KAT2A; SnapEDA_Link: https://www.snapeda.com/parts/0603YC223KAT2A/AVX/view-part/?ref=snap; Package: 1608 AVX; Value: *; Check_prices: https://www.snapeda.com/parts/0603YC223KAT2A/AVX/view-part/?ref=eda
E1 = MI1206K601R-10: as E3 on sheet PowerSupply; SnapEDA_Link: https://www.snapeda.com/parts/MI1206K601R-10/Laird-Signal+Integrity+Products/view-part/?ref=snap; Package: 1206 Laird; Value: *; MP: MI1206K601R-10; Check_prices: https://www.snapeda.com/parts/MI1206K601R-10/Laird-Signal+Integrity+Products/view-part/?ref=eda
J8 = TLV70233DBVR: 300-mA, high-PSRR, low-IQ, low-dropout voltage regulator with enable; MF: Texas Instruments; SnapEDA_Link: https://www.snapeda.com/parts/TLV70233DBVR/Texas+Instruments/view-part/?ref=snap; Package: SOT-23-5 Texas Instruments; Value: *; MP: TLV70233DBVR; Check_prices: https://www.snapeda.com/parts/TLV70233DBVR/Texas+Instruments/view-part/?ref=eda
J9 J10 = KF301-2P: as J15 on sheet PowerSupply; SnapEDA_Link: https://www.snapeda.com/parts/KF301-2P/Handson+Technology/view-part/?ref=snap; Package: None; Value: *; MP: KF301-2P; Check_prices: https://www.snapeda.com/parts/KF301-2P/Handson+Technology/view-part/?ref=eda
R28 R40 = 0603_33k_1: 33kOhm; MF: Bourns; MP: CRT0603-FY-1000ELF; Purchase-URL: https://pricing.snapeda.com/search/part/CRT0603-FY-1000ELF/?ref=eda; Value: *; SnapEDA_Link: https://www.snapeda.com/parts/CRT0603-FY-1000ELF/Bourns/view-part/?ref=snap; Package: 1508 Bourns; Check_prices: https://www.snapeda.com/parts/CRT0603-FY-1000ELF/Bourns/view-part/?ref=eda; Digi-Key_Part_Number: 118-CRT0603-FY-1000ELFTR-ND
R29 R39 = 0603_22k: 22kOhm_0.1% to 0.5%; MF: Bourns; MP: CRT0603-FY-1000ELF; Purchase-URL: https://pricing.snapeda.com/search/part/CRT0603-FY-1000ELF/?ref=eda; Value: *; SnapEDA_Link: https://www.snapeda.com/parts/CRT0603-FY-1000ELF/Bourns/view-part/?ref=snap; Package: 1508 Bourns; Check_prices: https://www.snapeda.com/parts/CRT0603-FY-1000ELF/Bourns/view-part/?ref=eda; Digi-Key_Part_Number: 118-CRT0603-FY-1000ELFTR-ND
R30 R31 R34 R35 = 0603_10k: 10kOhm; MF: Bourns; MP: CRT0603-FY-1000ELF; Purchase-URL: https://pricing.snapeda.com/search/part/CRT0603-FY-1000ELF/?ref=eda; Value: *; SnapEDA_Link: https://www.snapeda.com/parts/CRT0603-FY-1000ELF/Bourns/view-part/?ref=snap; Package: 1508 Bourns; Check_prices: https://www.snapeda.com/parts/CRT0603-FY-1000ELF/Bourns/view-part/?ref=eda; Digi-Key_Part_Number: 118-CRT0603-FY-1000ELFTR-ND
R32 R37 = 0603_1.2K: 1.2k (0.1%-0.5%); MF: Bourns; MP: CRT0603-FY-1000ELF; Purchase-URL: https://pricing.snapeda.com/search/part/CRT0603-FY-1000ELF/?ref=eda; Value: *; SnapEDA_Link: https://www.snapeda.com/parts/CRT0603-FY-1000ELF/Bourns/view-part/?ref=snap; Package: 1508 Bourns; Check_prices: https://www.snapeda.com/parts/CRT0603-FY-1000ELF/Bourns/view-part/?ref=eda; Digi-Key_Part_Number: 118-CRT0603-FY-1000ELFTR-ND
R33 R36 R38 R41 = 0603_680Ohm: 680Ohm-0.1%; MF: Bourns; MP: CRT0603-FY-1000ELF; Purchase-URL: https://pricing.snapeda.com/search/part/CRT0603-FY-1000ELF/?ref=eda; Value: *; SnapEDA_Link: https://www.snapeda.com/parts/CRT0603-FY-1000ELF/Bourns/view-part/?ref=snap; Package: 1508 Bourns; Check_prices: https://www.snapeda.com/parts/CRT0603-FY-1000ELF/Bourns/view-part/?ref=eda; Digi-Key_Part_Number: 118-CRT0603-FY-1000ELFTR-ND
R42 R43 = 1206-1M: 1M Ohms Â±1% 0.25W, 1/4W Chip Resistor 1206 (3216 Metric) Moisture Resistant Thick Film; MF: Yageo; MP: RC1206JR-0713RL; SnapEDA_Link: https://www.snapeda.com/parts/RC1206JR-0713RL/Yageo/view-part/?ref=snap; Package: 3116 Yageo; Value: *; Check_prices: https://www.snapeda.com/parts/RC1206JR-0713RL/Yageo/view-part/?ref=eda
U7 = B0505S-1WR3: Description; Manufacturer_Name: MORNSUN; Type: DC DC Converters; Copyright: Copyright (C) 2026 Ultra Librarian. All rights reserved.; Manufacturer_Part_Number: B0505S-1WR3; RefDes: RefDes
U8 = AMC1301DWVR: 250 mV-Input Precision Reinforced Isolated Amplifier for Current Sensing 8-SOIC -40 to 125; MF: Texas Instruments; Check_prices: https://www.snapeda.com/parts/AMC1301DWVR/Texas+Instruments/view-part/?ref=eda; SnapEDA_Link: https://www.snapeda.com/parts/AMC1301DWVR/Texas+Instruments/view-part/?ref=snap; Availability: In Stock; Price: None; Value: *; MP: AMC1301DWVR; Package: SOIC-8 Texas Instruments; Purchase-URL: https://pricing.snapeda.com/search/part/AMC1301DWVR/?ref=eda
U9 U10 = OPA197IDR: Single, 36-V, precision, rail-to-rail input output, low offset voltage op amp 8-SOIC -40 to 125; Manufacturer_Name: Texas Instruments; TYPE: TYPE; RefDes: RefDes; Copyright: Copyright (C) 2026 Ultra Librarian. All rights reserved.; Manufacturer_Part_Number: OPA197IDR

## Sheet ADS8588.SchDoc
size A3 portrait; SheetNumber: 4; SheetTotal: 6
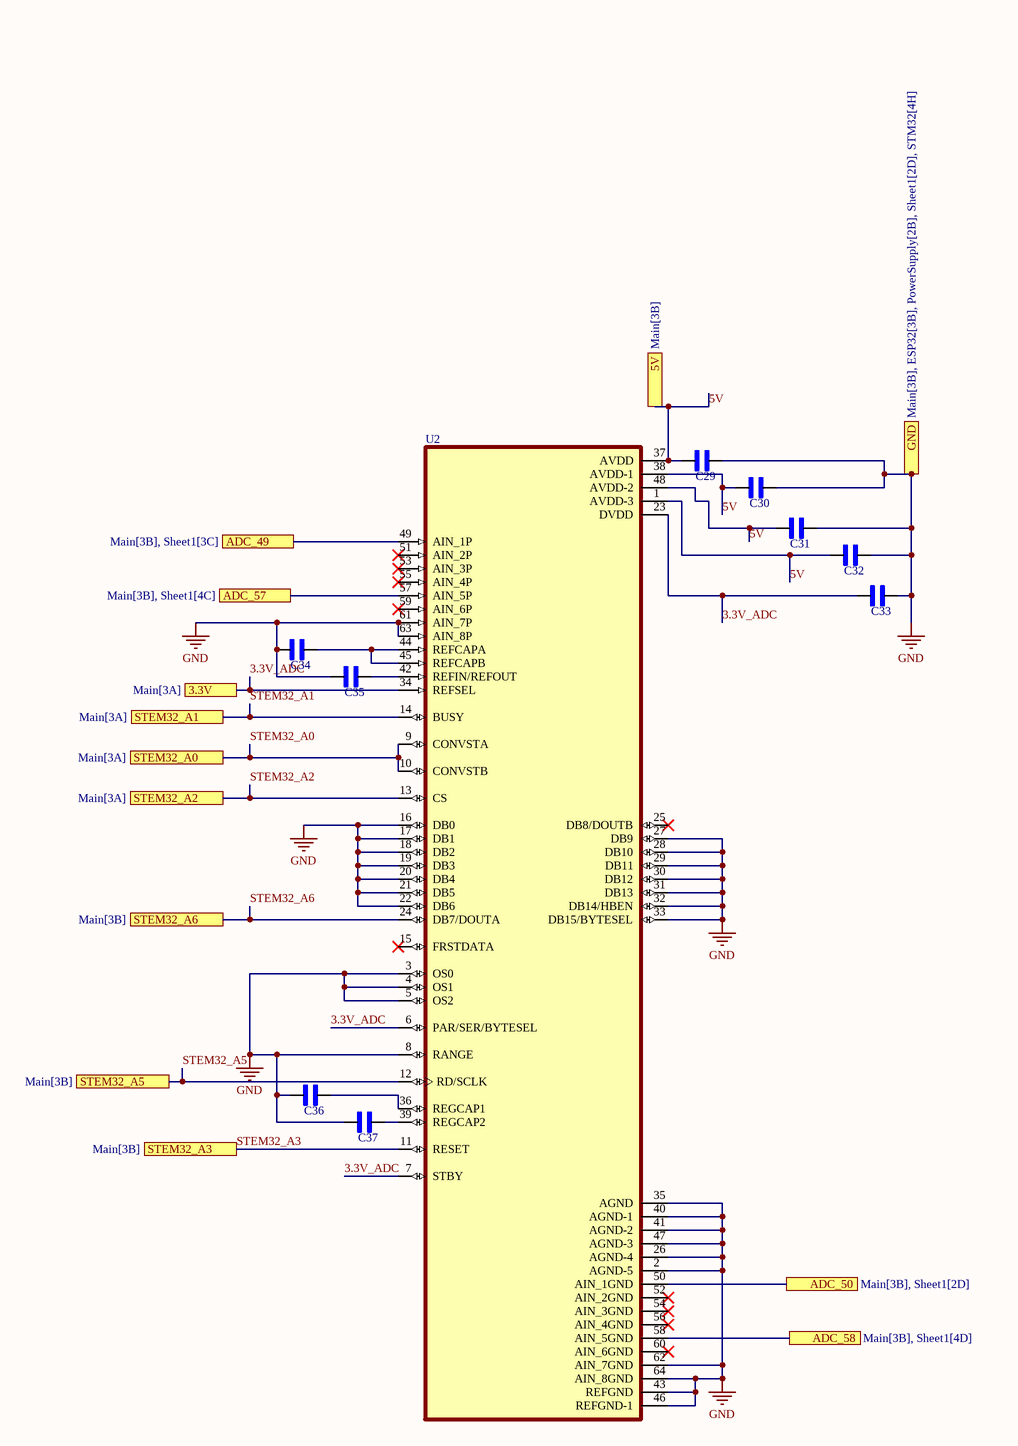
[diagram p4: ADS8588.SchDoc]

### Parts
C29  CAP603  [CAP603]  (value not drawn)
C30  CAP603  [CAP603]  (value not drawn)
C31  CAP603  [CAP603]  (value not drawn)
C32  CAP603  [CAP603]  (value not drawn)
C33  CAP603  [CAP603]  (value not drawn)
C34  CAP603  [CAP603]  (value not drawn)
C35  CAP603  [CAP603]  (value not drawn)
C36  CAP603  [CAP603]  (value not drawn)
C37  CAP603  [CAP603]  (value not drawn)
U2  ADS8588SIPM  [ADS8588SIPM]  (value not drawn)

### Ports
3.3V (see Main[3A]), 5V (see Main[3B]), ADC_49 (see Main[3B], Sheet1[3C]), ADC_50 (see Main[3B], Sheet1[2D]), ADC_57 (see Main[3B], Sheet1[4C]), ADC_58 (see Main[3B], Sheet1[4D]), GND (see Main[3B], ESP32[3B], PowerSupply[2B], Sheet1[2D], STM32[4H]), STEM32_A0 (see Main[3A]), STEM32_A1 (see Main[3A]), STEM32_A2 (see Main[3A]), STEM32_A3 (see Main[3B]), STEM32_A5 (see Main[3B]), STEM32_A6 (see Main[3B])

### Nets
GND: C29.2 C30.2 C31.2 C32.2 C33.2 C34.1 C35.1 C36.1 C37.1 U2.2(AGND-5) U2.3(OS0) U2.4(OS1) U2.5(OS2) U2.8(RANGE) U2.16(DB0) U2.17(DB1) U2.18(DB2) U2.19(DB3) U2.20(DB4) U2.21(DB5) U2.22(DB6) U2.26(AGND-4) U2.27(DB9) U2.28(DB10) U2.29(DB11) U2.30(DB12) U2.31(DB13) U2.32(DB14/HBEN) U2.33(DB15/BYTESEL) U2.35(AGND) U2.40(AGND-1) U2.41(AGND-2) U2.43(REFGND) U2.46(REFGND-1) U2.47(AGND-3) U2.61(AIN_7P) U2.62(AIN_7GND) U2.63(AIN_8P) U2.64(AIN_8GND) ; port GND
3.3V_ADC: C33.1 U2.6(PAR/SER/BYTESEL) U2.7(STBY) U2.23(DVDD) U2.34(REFSEL) ; port 3.3V
5V: C29.1 C30.1 C31.1 C32.1 U2.1(AVDD-3) U2.37(AVDD) U2.38(AVDD-1) U2.48(AVDD-2) ; port 5V
ADC_49: U2.49(AIN_1P) ; port ADC_49
ADC_50: U2.50(AIN_1GND) ; port ADC_50
ADC_57: U2.57(AIN_5P) ; port ADC_57
ADC_58: U2.58(AIN_5GND) ; port ADC_58
STEM32_A0: U2.9(CONVSTA) U2.10(CONVSTB) ; port STEM32_A0
STEM32_A1: U2.14(BUSY) ; port STEM32_A1
STEM32_A2: U2.13(CS) ; port STEM32_A2
STEM32_A3: U2.11(RESET) ; port STEM32_A3
STEM32_A5: U2.12(RD/SCLK) ; port STEM32_A5
STEM32_A6: U2.24(DB7/DOUTA) ; port STEM32_A6
NetC34_2: C34.2 U2.44(REFCAPA) U2.45(REFCAPB)
NetC35_2: C35.2 U2.42(REFIN/REFOUT)
NetC36_2: C36.2 U2.36(REGCAP1)
NetC37_2: C37.2 U2.39(REGCAP2)

Not connected (* = marked no-connect by the designer): U2 15(FRSTDATA)* 25(DB8/DOUTB)* 51(AIN_2P)* 52(AIN_2GND)* 53(AIN_3P)* 54(AIN_3GND)* 55(AIN_4P)* 56(AIN_4GND)* 59(AIN_6P)* 60(AIN_6GND)*

### Notes on the sheet
- Title
- Size:
- Date:
- A3
- Number:
- Time:
- Revision:
- Sheet
- of
- File:

### Library data of the parts
C29-C37 = CAP603: as C40 on sheet PowerSupply; SnapEDA_Link: https://www.snapeda.com/parts/VJ0603Y104JXQCW1BC/Vishay/view-part/?ref=snap; Package: 0603-2 VISHAY; Value: *; Check_prices: https://www.snapeda.com/parts/VJ0603Y104JXQCW1BC/Vishay/view-part/?ref=eda
U2 = ADS8588SIPM: 16-Bit High-Speed 8-Channel Simultaneous-Sampling ADC With Bipolar Inputs on a Single Supply 64-LQFP -40 to 125; MF: Texas Instruments; Value: *; SnapEDA_Link: https://www.snapeda.com/parts/ADS8588SIPM/Texas+Instruments/view-part/?ref=snap; Purchase-URL: https://pricing.snapeda.com/search/part/ADS8588SIPM/?ref=eda; Availability: In Stock; Price: None; Package: LQFP-64 Texas Instruments; Check_prices: https://www.snapeda.com/parts/ADS8588SIPM/Texas+Instruments/view-part/?ref=eda; MP: ADS8588SIPM

## Sheet ESP32.SchDoc
size 420 x 297 mm; SheetNumber: 3; SheetTotal: 6
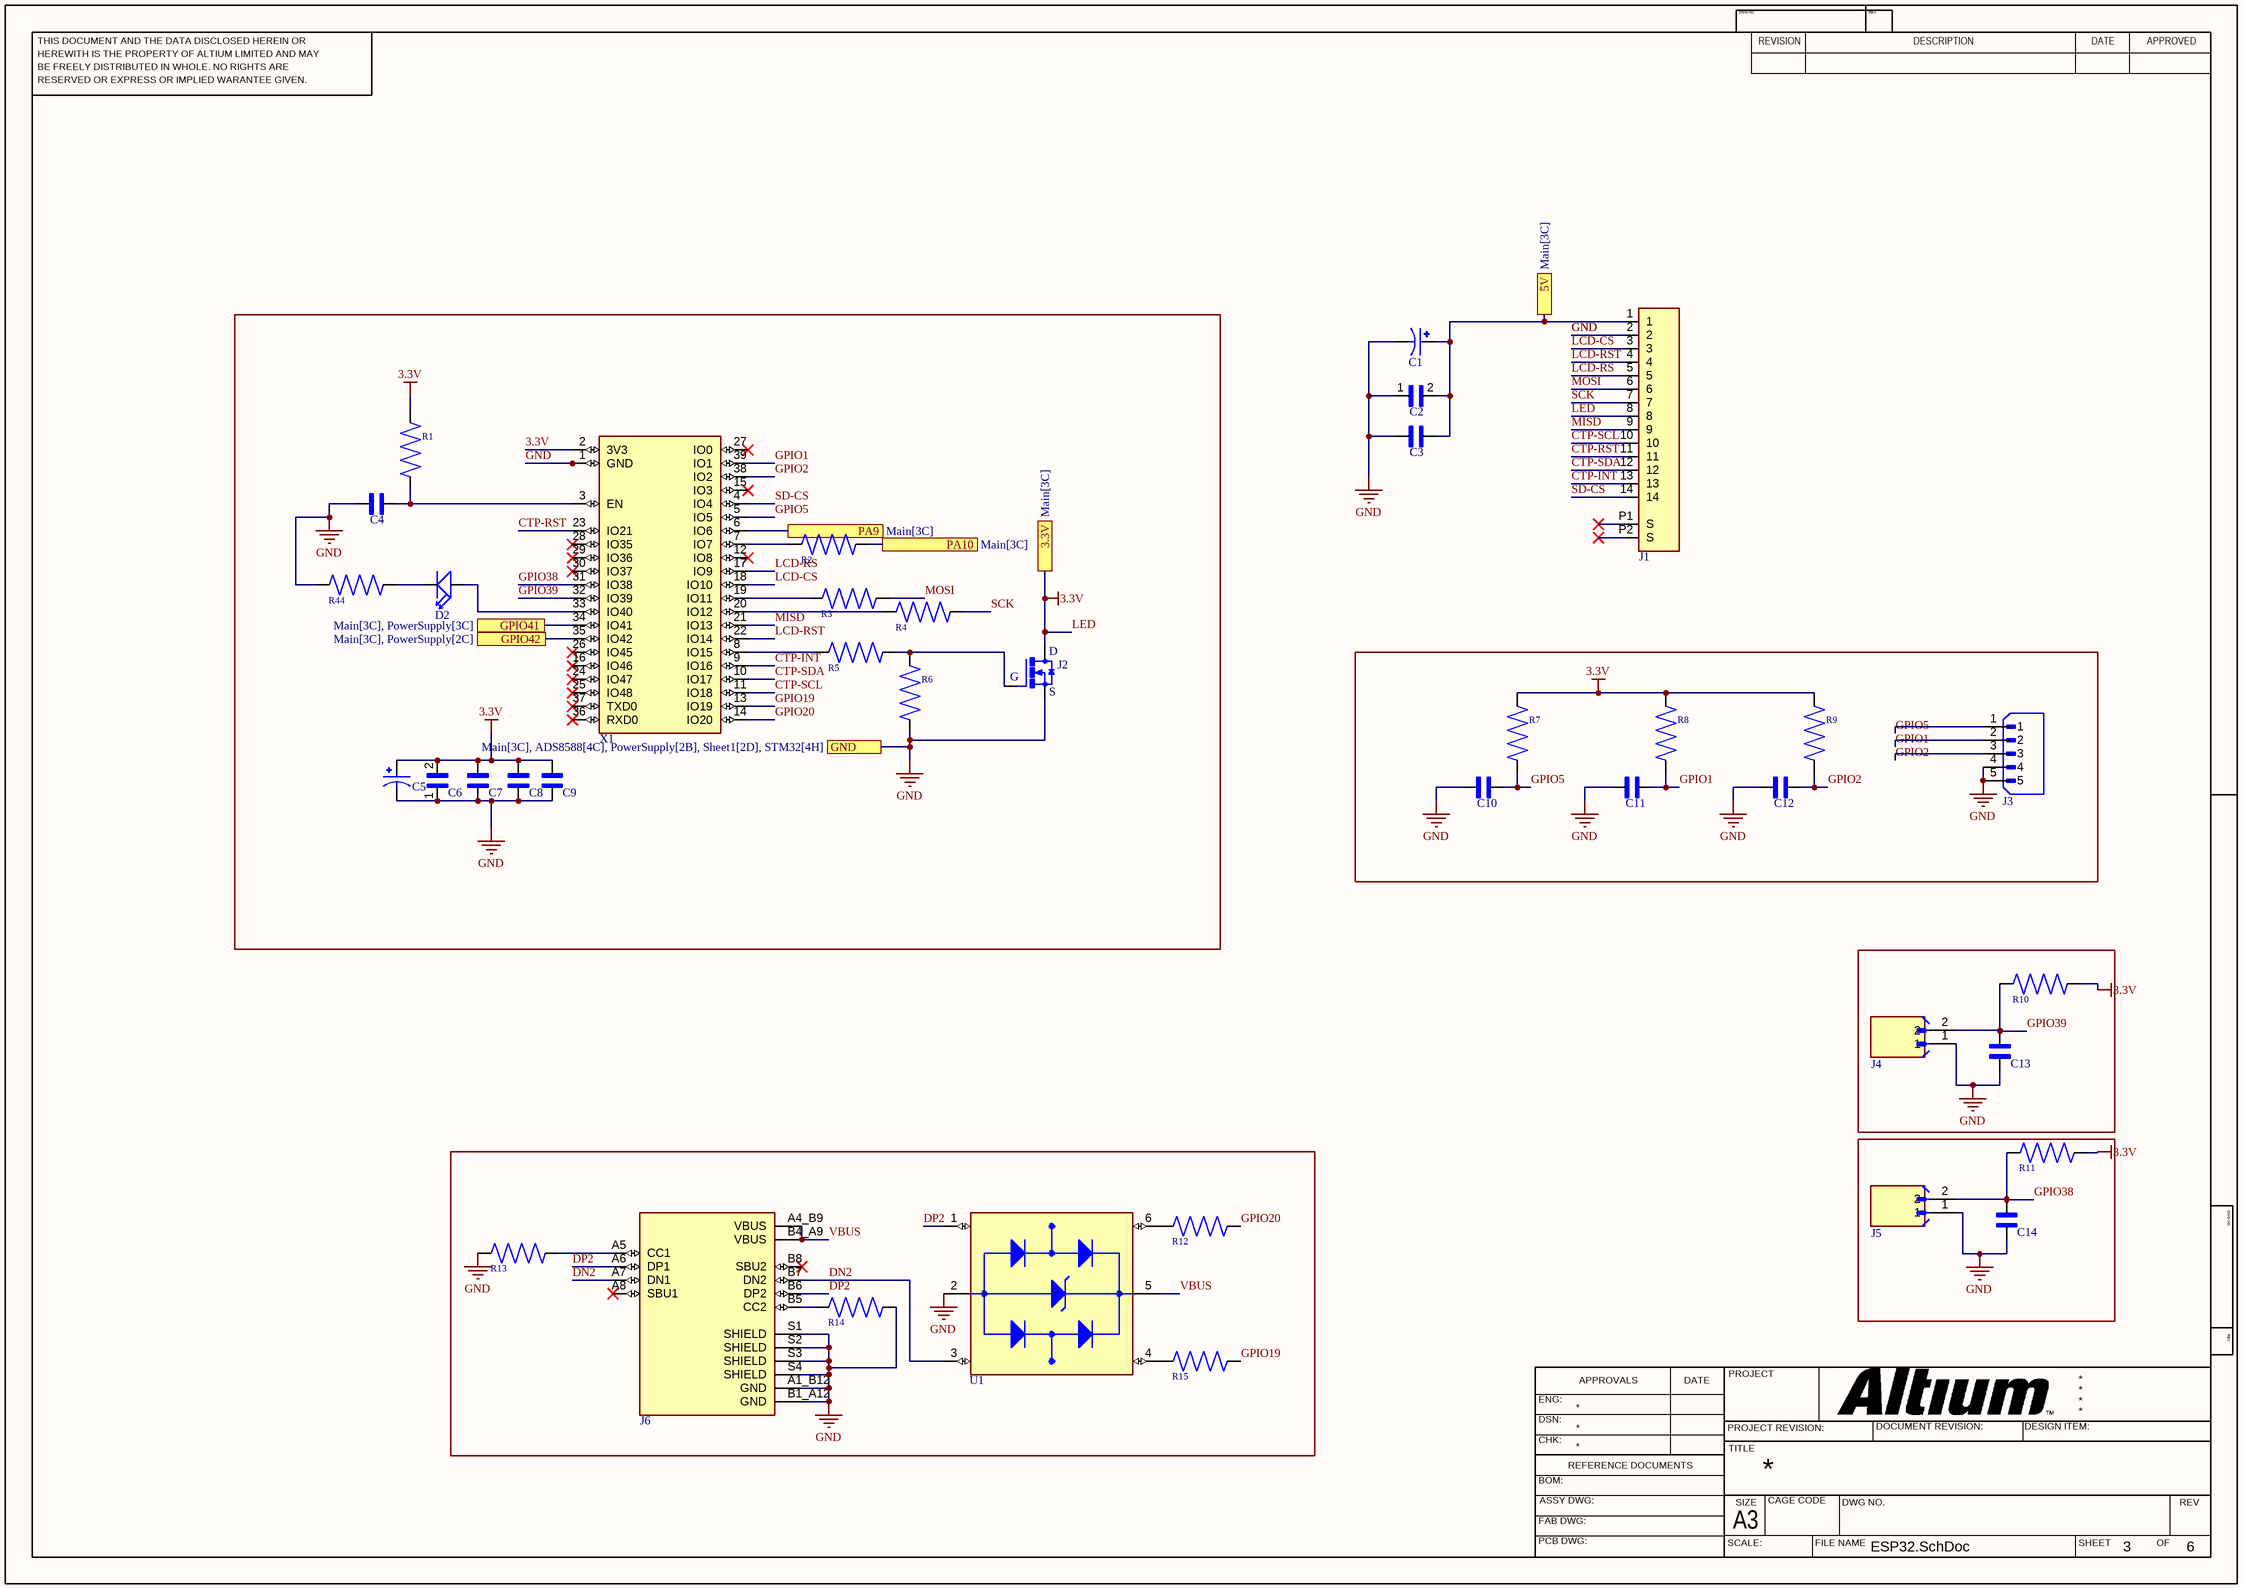
[diagram p5: ESP32.SchDoc]

### Parts
C1  100 uF  [100 uF]  (value not drawn)
C2  C2012X7R1H104K085AA  [CAPC2012X100N]  (value not drawn)
C3  CAP603  [CAP603]  (value not drawn)
C4  CAP603  [CAP603]  (value not drawn)
C5  100 uF  [100 uF]  (value not drawn)
C6  C2012X7R1H104K085AA  [CAPC2012X100N]  (value not drawn)
C7  CAP603  [CAP603]  (value not drawn)
C8  CAP603  [CAP603]  (value not drawn)
C9  CAP603  [CAP603]  (value not drawn)
C10  CAP603  [CAP603]  (value not drawn)
C11  CAP603  [CAP603]  (value not drawn)
C12  CAP603  [CAP603]  (value not drawn)
C13  CAP603  [CAP603]  (value not drawn)
C14  CAP603  [CAP603]  (value not drawn)
D2  SMD-LED-YELLOW-WHITE(0603)  [LED-0603]  (value not drawn)
J1  FPC-connector  [FPC-connector]  (value not drawn)
J2  AO3400  [AO3400]  (value not drawn)
J3  5-pin jst  [5-pin jst]  (value not drawn)
J4  2-pin jst  [2-pin jst]  (value not drawn)
J5  2-pin jst  [2-pin jst]  (value not drawn)
J6  TYPE-C-31-M-12  [TYPE-C-31-M-12]  (value not drawn)
R1  RES-603  [CAP603]  (value not drawn)
R2  RES-603  [CAP603]  (value not drawn)
R3  RES-603  [CAP603]  (value not drawn)
R4  RES-603  [CAP603]  (value not drawn)
R5  RES-603  [CAP603]  (value not drawn)
R6  RES-603  [CAP603]  (value not drawn)
R7  RES-603  [CAP603]  (value not drawn)
R8  RES-603  [CAP603]  (value not drawn)
R9  RES-603  [CAP603]  (value not drawn)
R10  RES-603  [CAP603]  (value not drawn)
R11  RES-603  [CAP603]  (value not drawn)
R12  RES-603  [CAP603]  (value not drawn)
R13  RES-603  [CAP603]  (value not drawn)
R14  RES-603  [CAP603]  (value not drawn)
R15  RES-603  [CAP603]  (value not drawn)
R44  RES-603  [CAP603]  (value not drawn)
U1  USBLC6-2SC6  [USBLC6-2SC6]  (value not drawn)
X1  ESP32-S3-WROOM-1-N16R8  [ESP32S3WROOM1N8R2]  (value not drawn)

### Ports
3.3V (see Main[3C]), 5V (see Main[3C]), GND (see Main[3C], ADS8588[4C], PowerSupply[2B], Sheet1[2D], STM32[4H]), GPIO41 (see Main[3C], PowerSupply[3C]), GPIO42 (see Main[3C], PowerSupply[2C]), PA9 (see Main[3C]), PA10 (see Main[3C])

### Nets
3.3V: C5.1 C6.2 C7.2 C8.2 C9.2 J1.8 J2.3(D) R1.2 R7.2 R8.2 R9.2 R10.1 R11.1 X1.2(3V3) ; port 3.3V  [also labelled LED]
+5: C1.1 C2.2 C3.1 J1.1 ; port 5V
GND: C1.2 C2.1 C3.2 C4.2 C5.2 C6.1 C7.1 C8.1 C9.1 C10.2 C11.2 C12.2 C13.1 C14.1 J1.2 J2.2(S) J3.4 J3.5 J4.1 J5.1 J6.A1_B12(GND) J6.B1_A12(GND) J6.S1(SHIELD) J6.S2(SHIELD) J6.S3(SHIELD) J6.S4(SHIELD) R6.1 R13.2 R14.1 R44.1 U1.2(GND) X1.1(GND) X1.40(GND) X1.41(GND) X1.42(GND) X1.43(GND) X1.44(GND) X1.45(GND) X1.46(GND) X1.47(GND) X1.48(GND) X1.49(GND) ; port GND
CTP-INT: J1.13 X1.9(IO16)
CTP-RST: J1.11 X1.23(IO21)
CTP-SCL: J1.10 X1.11(IO18)
CTP-SDA: J1.12 X1.10(IO17)
DN2: J6.A7(DN1) J6.B7(DN2) U1.3(I/O2_IN)
DP2: J6.A6(DP1) J6.B6(DP2) U1.1(I/O1_IN)
GPIO1: C11.1 J3.2 R8.1 X1.39(IO1)
GPIO2: C12.1 J3.3 R9.1 X1.38(IO2)
GPIO5: C10.1 J3.1 R7.1 X1.5(IO5)
GPIO19: R15.1 X1.13(IO19)
GPIO20: R12.1 X1.14(IO20)
GPIO38: C14.2 J5.2 R11.2 X1.31(IO38)
GPIO39: C13.2 J4.2 R10.2 X1.32(IO39)
GPIO41: X1.34(IO41) ; port GPIO41
GPIO42: X1.35(IO42) ; port GPIO42
LCD-CS: J1.3 X1.18(IO10)
LCD-RS: J1.5 X1.17(IO9)
LCD-RST: J1.4 X1.22(IO14)
MISD: J1.9 X1.21(IO13)
MOSI: J1.6 R3.1
PA9: X1.6(IO6) ; port PA9
PA10: R2.1 ; port PA10
SCK: J1.7 R4.1
SD-CS: J1.14 X1.4(IO4)
VBUS: J6.A4_B9(VBUS) J6.B4_A9(VBUS) U1.5(VBUS)
NetC4_1: C4.1 R1.1 X1.3(EN)
NetD2_NEG: D2.NEG R44.2
NetD2_POS: D2.POS X1.33(IO40)
NetJ2_1: J2.1(G) R5.1 R6.2
NetJ6_A5: J6.A5(CC1) R13.1
NetJ6_B5: J6.B5(CC2) R14.2
NetR2_2: R2.2 X1.7(IO7)
NetR3_2: R3.2 X1.19(IO11)
NetR4_2: R4.2 X1.20(IO12)
NetR5_2: R5.2 X1.8(IO15)
NetR12_2: R12.2 U1.6(I/O1_OUT)
NetR15_2: R15.2 U1.4(I/O2_OUT)

Not connected (* = marked no-connect by the designer): J1 P1(S)* P2(S)*; J6 A8(SBU1)* B8(SBU2)*; X1 12(IO8)* 15(IO3)* 16(IO46)* 24(IO47)* 25(IO48)* 26(IO45)* 27(IO0)* 28(IO35)* 29(IO36)* 30(IO37)* 36(RXD0)* 37(TXD0)*

### Notes on the sheet
- THIS DOCUMENT AND THE DATA DISCLOSED HEREIN OR
- HEREWITH IS THE PROPERTY OF ALTIUM LIMITED AND MAY
- DWG NO:
- REVISION
- REV:
- DESCRIPTION
- DATE
- APPROVED
- BE FREELY DISTRIBUTED IN WHOLE. NO RIGHTS ARE
- RESERVED OR EXPRESS OR IMPLIED WARANTEE GIVEN.
- ENG:
- APPROVALS
- PROJECT
- DSN:
- CHK:
- REFERENCE DOCUMENTS
- PROJECT REVISION:
- TITLE
- DOCUMENT REVISION:
- DESIGN ITEM:
- BOM:
- FAB DWG:
- PCB DWG:
- ASSY DWG:
- SCALE:
- A3
- SIZE
- CAGE CODE
- FILE NAME
- DWG NO.
- SHEET
- OF
- REV

### Library data of the parts
C1 C5 = 100 uF: as C38 on sheet PowerSupply; SnapEDA_Link: https://www.snapeda.com/parts/16SVPG100M/Panasonic/view-part/?ref=snap; Package: None; Value: *; MF: Panasonic; MP: 16SVPG100M; Check_prices: https://www.snapeda.com/parts/16SVPG100M/Panasonic/view-part/?ref=eda
C2 C6 = C2012X7R1H104K085AA: as C39 on sheet PowerSupply; Purchase-URL: https://pricing.snapeda.com/search/part/C2012X7R1H104K085AA/?ref=eda; Package: 2012 TDK; MP: C2012X7R1H104K085AA; Value: *; SnapEDA_Link: https://www.snapeda.com/parts/C2012X7R1H104K085AA/TDK/view-part/?ref=snap; Digi-Key_Part_Number: 445-7534-1-ND; Check_prices: https://www.snapeda.com/parts/C2012X7R1H104K085AA/TDK/view-part/?ref=eda
C3 C4 C7-C14 = CAP603: as C40 on sheet PowerSupply; SnapEDA_Link: https://www.snapeda.com/parts/VJ0603Y104JXQCW1BC/Vishay/view-part/?ref=snap; Package: 0603-2 VISHAY; Value: *; Check_prices: https://www.snapeda.com/parts/VJ0603Y104JXQCW1BC/Vishay/view-part/?ref=eda
D2 = SMD-LED-YELLOW-WHITE(0603): as D on sheet STM32; SnapEDA_Link: https://www.snapeda.com/parts/ADL-0603W/Chengguangxing/view-part/106378/?ref=snap; Availability: Unavailable; Value: *; Price: None; Package: None
J1 = FPC-connector: 14 Position FPC Connector Contacts, Top 0.020 (0.50mm) Surface Mount, Right Angle; MF: TE Connectivity; MP: 1-1734839-4; SnapEDA_Link: https://www.snapeda.com/parts/1-1734839-4/TE+Connectivity+AMP+Connectors/view-part/?ref=snap; Package: None; Value: *; EU_RoHS_Compliance: Compliant; Check_prices: https://www.snapeda.com/parts/1-1734839-4/TE+Connectivity+AMP+Connectors/view-part/?ref=eda
J2 = AO3400: N-Channel 30 V 5.8A (Ta) 1.4W (Ta) Surface Mount SOT-23-3; MF: Alpha &; SnapEDA_Link: https://www.snapeda.com/parts/AO3400/Alpha/view-part/?ref=snap; Package: SOT-23-3 Alpha &amp; Omega Semiconductor; MP: AO3400; Check_prices: https://www.snapeda.com/parts/AO3400/Alpha/view-part/?ref=eda; Value: *
J3 = 5-pin jst: Connector Header Through Hole 5 position 0.098 (2.50mm); MF: JST Sales America Inc.; MP: B5B-XH-A(LF)(SN); SnapEDA_Link: https://www.snapeda.com/parts/B5B-XH-A(LF)(SN)/JST+Sales+America+Inc./view-part/?ref=snap; Package: None; Value: *; Check_prices: https://www.snapeda.com/parts/B5B-XH-A(LF)(SN)/JST+Sales+America+Inc./view-part/?ref=eda
J4 J5 = 2-pin jst: as J16 on sheet PowerSupply; SnapEDA_Link: https://www.snapeda.com/parts/B2B-PH-K-S/JST/view-part/?ref=snap; Package: None; Value: *; Check_prices: https://www.snapeda.com/parts/B2B-PH-K-S/JST/view-part/?ref=eda
J6 = TYPE-C-31-M-12: USB Connectors 24 Receptacle 1 8.94*7.3mm RoHS; MF: HRO Electronics Co., Ltd.; SnapEDA_Link: https://www.snapeda.com/parts/TYPE-C-31-M-12/HRO+Electronics+Co.%252C+Ltd./view-part/?ref=snap; Package: Package; Value: *; MP: TYPE-C-31-M-12; Check_prices: https://www.snapeda.com/parts/TYPE-C-31-M-12/HRO+Electronics+Co.%252C+Ltd./view-part/?ref=eda
R1-R15 R44 = RES-603: MF: Yageo; MP: RC0805FR-0710KL; Value: *; SnapEDA_Link: https://www.snapeda.com/parts/RC0805FR-0710KL/Yageo/view-part/?ref=snap; Purchase-URL: https://pricing.snapeda.com/search/part/RC0805FR-0710KL/?ref=eda; Availability: In Stock; Price: None; Package: 2012 Rohm Semiconductor; Check_prices: https://www.snapeda.com/parts/RC0805FR-0710KL/Yageo/view-part/?ref=eda
U1 = USBLC6-2SC6: 17V Clamp 5A (8/20Âµs) Ipp Tvs Diode Surface Mount SOT-23-6; MF: STMicroelectronics; Value: *; SnapEDA_Link: https://www.snapeda.com/parts/USBLC6-2SC6/STMicroelectronics/view-part/?ref=snap; Check_prices: https://www.snapeda.com/parts/USBLC6-2SC6/STMicroelectronics/view-part/?ref=eda; Purchase-URL: https://pricing.snapeda.com/search/part/USBLC6-2SC6/?ref=eda; Price: None; Availability: In Stock; Package: SOT-23-6 STMicroelectronics; MP: USBLC6-2SC6
X1 = ESP32-S3-WROOM-1-N16R8: Bluetooth, WiFi 802.11b/g/n, Bluetooth v5.0 Transceiver Module 2.4GHz PCB Trace Surface Mount; MF: Espressif Systems; SnapEDA_Link: https://www.snapeda.com/parts/ESP32-S3-WROOM-1-N16R8/Espressif+Systems/view-part/?ref=snap; Package: NON STANDARD Espressif Systems; Value: *; MP: ESP32-S3-WROOM-1-N16R8; Check_prices: https://www.snapeda.com/parts/ESP32-S3-WROOM-1-N16R8/Espressif+Systems/view-part/?ref=eda

## Nets that join several sheets
3.3V: PowerSupply (5 pins), ESP32 (14 pins)
+5: PowerSupply (18 pins), Sheet1 (8 pins), ESP32 (C1.1 C2.2 C3.1 J1.1)
GND: PowerSupply (30 pins), STM32 (27 pins), Sheet1 (15 pins), ADS8588 (39 pins), ESP32 (42 pins)
VOUT: PowerSupply (5 pins), Sheet1 (C75.1 C76.1 U9.4 U10.4)
3.3V_ADC: PowerSupply (C47.2 C48.2 E3.1), ADS8588 (5 pins)
5V: PowerSupply (C39.2 C40.2 C41.2 E4.1), ADS8588 (8 pins)
ADC_49: Sheet1 (C78.2 R33.2), ADS8588 (U2.49)
ADC_50: Sheet1 (C78.1 R41.2), ADS8588 (U2.50)
ADC_57: Sheet1 (C77.2 R36.2), ADS8588 (U2.57)
ADC_58: Sheet1 (C77.1 R38.2), ADS8588 (U2.58)
GPIO41: PowerSupply (R24.2), ESP32 (X1.34)
GPIO42: PowerSupply (R26.2 U5.5), ESP32 (X1.35)
PA9: STM32 (U12.32), ESP32 (X1.6)
PA10: STM32 (U12.33), ESP32 (R2.1)
STEM32 3.3V: PowerSupply (7 pins), STM32 (16 pins)
STEM32_A0: STM32 (U12.10), ADS8588 (U2.9 U2.10)
STEM32_A1: STM32 (U12.11), ADS8588 (U2.14)
STEM32_A2: STM32 (U12.12), ADS8588 (U2.13)
STEM32_A3: STM32 (U12.13), ADS8588 (U2.11)
STEM32_A5: STM32 (U12.15), ADS8588 (U2.12)
STEM32_A6: STM32 (U12.16), ADS8588 (U2.24)